# Altium schematic sheet CODEC.SchDoc: Audio Codec
size A3; Author: Vi Tín; SheetNumber: 11; SheetTotal: 15
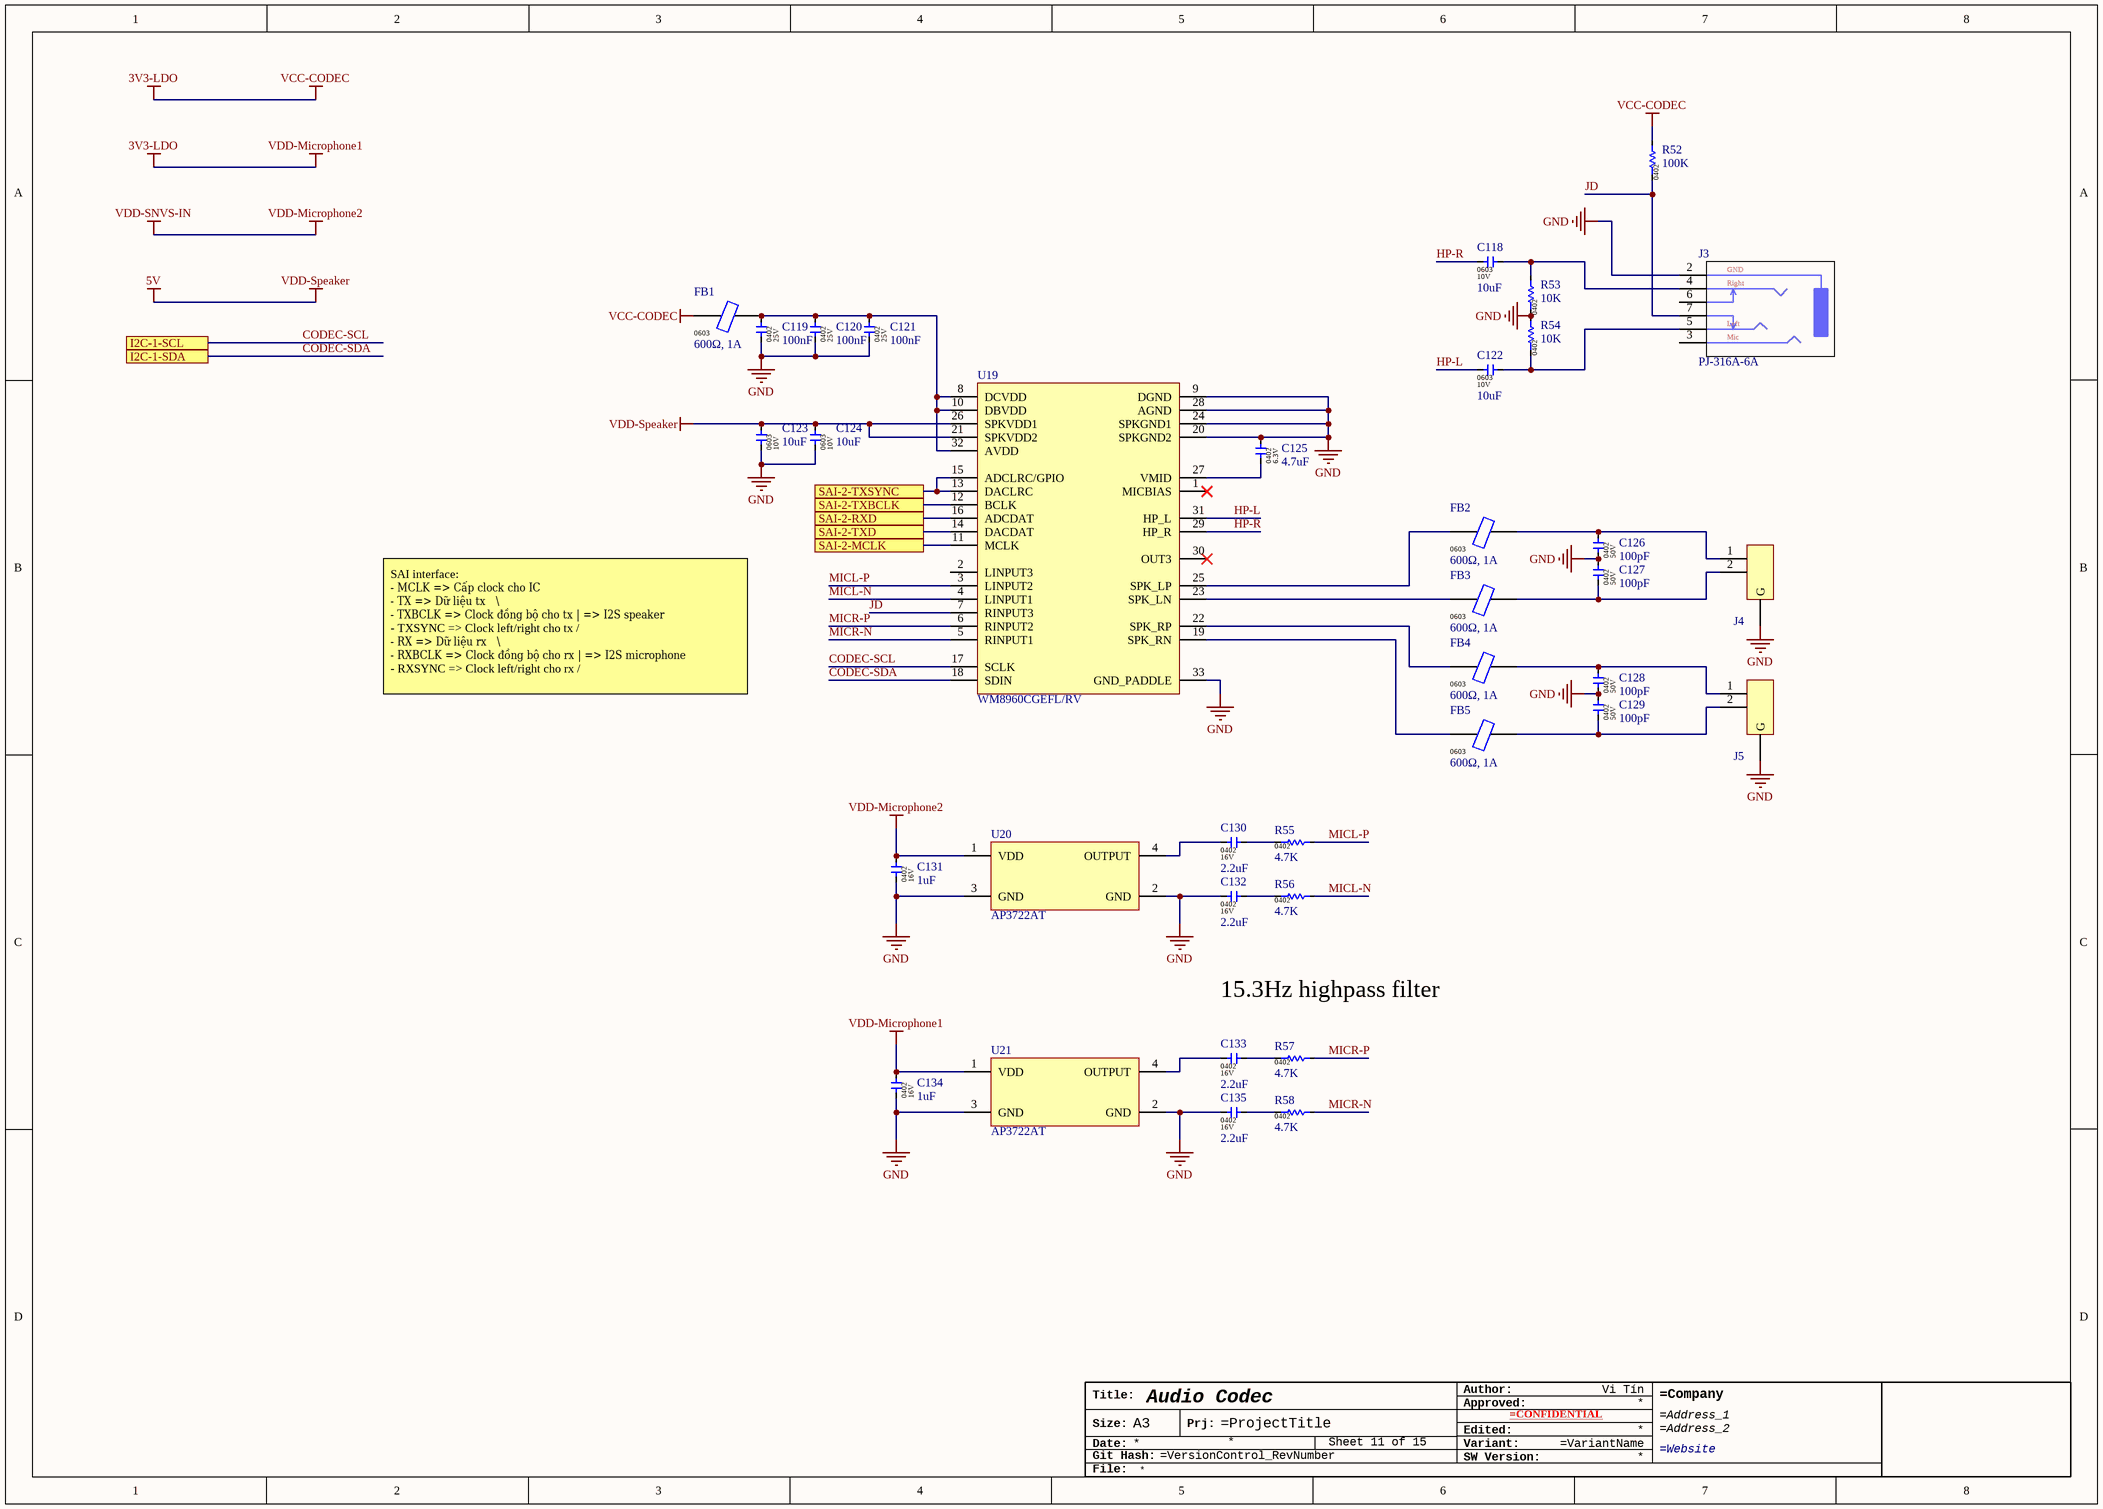
[diagram p0: CODEC.SchDoc]

## Parts
*?  TitleBlock_Generic  (value not drawn)  (graphical)
C118  10uF  [CAP-0603]
C119  100nF  [CAP-0402]
C120  100nF  [CAP-0402]
C121  100nF  [CAP-0402]
C122  10uF  [CAP-0603]
C123  10uF  [CAP-0603]
C124  10uF  [CAP-0603]
C125  4.7uF  [CAP-0402]
C126  100pF  [CAP-0402]
C127  100pF  [CAP-0402]
C128  100pF  [CAP-0402]
C129  100pF  [CAP-0402]
C130  2.2uF  [CAP-0402]
C131  1uF  [CAP-0402]
C132  2.2uF  [CAP-0402]
C133  2.2uF  [CAP-0402]
C134  1uF  [CAP-0402]
C135  2.2uF  [CAP-0402]
FB1  600Ω, 1A  [Ferrite-0603]
FB2  600Ω, 1A  [Ferrite-0603]
FB3  600Ω, 1A  [Ferrite-0603]
FB4  600Ω, 1A  [Ferrite-0603]
FB5  600Ω, 1A  [Ferrite-0603]
J3  PJ-316A-6A  [Audio 3.5mm, 6 pin]
J4  1.25T-2P-WT  [Conn MX1.25 (2)]  (value not drawn)
J5  1.25T-2P-WT  [Conn MX1.25 (2)]  (value not drawn)
R52  100K  [RES-0402]
R53  10K  [RES-0402]
R54  10K  [RES-0402]
R55  4.7K  [RES-0402]
R56  4.7K  [RES-0402]
R57  4.7K  [RES-0402]
R58  4.7K  [RES-0402]
U19  WM8960CGEFL/RV  [QFN32-5X5MM_PAD]
U20  AP3722AT  [AP3722AT]
U21  AP3722AT  [AP3722AT]

## Ports
I2C-1-SCL, I2C-1-SDA, SAI-2-MCLK, SAI-2-RXD, SAI-2-TXBCLK, SAI-2-TXD, SAI-2-TXSYNC

## Nets
3V3-LDO: C134.2 FB1.1 R52.2 U21.1(VDD)  [also labelled VCC-CODEC, VDD-Microphone1]
5V: C123.2 C124.2 U19.21(SPKVDD2) U19.26(SPKVDD1)  [also labelled VDD-Speaker]
GND: C119.1 C120.1 C121.1 C123.1 C124.1 C125.2 C126.1 C127.2 C128.1 C129.2 C131.1 C132.1 C134.1 C135.1 J3.2 J4.0(G) J5.0(G) R53.1 R54.2 U19.9(DGND) U19.20(SPKGND2) U19.24(SPKGND1) U19.28(AGND) U19.33(GND_PADDLE) U20.2(GND) U20.3(GND) U21.2(GND) U21.3(GND)
VDD-Microphone2: C131.2 U20.1(VDD)  [also labelled VDD-SNVS-IN]
CODEC-SCL: U19.17(SCLK) ; port I2C-1-SCL
CODEC-SDA: U19.18(SDIN) ; port I2C-1-SDA
HP-L: C122.1 U19.31(HP_L)
HP-R: C118.1 U19.29(HP_R)
JD: J3.7 R52.1 U19.7(RINPUT3)
MICL-N: R56.2 U19.4(LINPUT1)
MICL-P: R55.2 U19.3(LINPUT2)
MICR-N: R58.2 U19.5(RINPUT1)
MICR-P: R57.2 U19.6(RINPUT2)
SAI-2-MCLK: U19.11(MCLK) ; port SAI-2-MCLK
SAI-2-RXD: U19.16(ADCDAT) ; port SAI-2-RXD
SAI-2-TXBCLK: U19.12(BCLK) ; port SAI-2-TXBCLK
SAI-2-TXD: U19.14(DACDAT) ; port SAI-2-TXD
SAI-2-TXSYNC: U19.13(DACLRC) U19.15(ADCLRC/GPIO) ; port SAI-2-TXSYNC
NetC118_2: C118.2 J3.4 R53.2
NetC119_2: C119.2 C120.2 C121.2 FB1.2 U19.8(DCVDD) U19.10(DBVDD) U19.32(AVDD)
NetC122_2: C122.2 J3.5 R54.1
NetC125_1: C125.1 U19.27(VMID)
NetC126_2: C126.2 FB2.2 J4.1
NetC127_1: C127.1 FB3.2 J4.2
NetC128_2: C128.2 FB4.2 J5.1
NetC129_1: C129.1 FB5.2 J5.2
NetC130_1: C130.1 U20.4(OUTPUT)
NetC130_2: C130.2 R55.1
NetC132_2: C132.2 R56.1
NetC133_1: C133.1 U21.4(OUTPUT)
NetC133_2: C133.2 R57.1
NetC135_2: C135.2 R58.1
NetFB2_1: FB2.1 U19.25(SPK_LP)
NetFB3_1: FB3.1 U19.23(SPK_LN)
NetFB4_1: FB4.1 U19.22(SPK_RP)
NetFB5_1: FB5.1 U19.19(SPK_RN)

Not connected (* = marked no-connect by the designer): J3 3 6; U19 1(MICBIAS)* 2(LINPUT3) 30(OUT3)*

## Notes on the sheet
- SAI interface:
  - MCLK => Cấp clock cho IC
  - TX => Dữ liệu tx			\
  - TXBCLK => Clock đồng bộ cho tx	| => I2S speaker
  - TXSYNC => Clock left/right cho tx	/
  - RX => Dữ liệu rx			\
  - RXBCLK => Clock đồng bộ cho rx	| => I2S microphone
  - RXSYNC => Clock left/right cho rx	/
- 15.3Hz highpass filter
- (in symbol PJ-316A-6A) GND; Right; Left; Mic
- (in symbol TitleBlock_Generic) Author:; Title:; Approved:; Size:; A3; Prj:; Edited:; Date:; Variant:; SW Version:; Git Hash:; File:

## Library data of the parts
C118 C122-C124 = 0603X106M100CT: 10uF ±20% 10V X5R 0603 Multilayer Ceramic Capacitors MLCC - SMD/SMT RoHS; Manufacture: WALSIN; Package / Case: 0402; Component type: Capacitor; Manufacture part: 0603X106M100CT; Capacitor value: 10uF; Voltage: 10V; Package: 0603
C119-C121 = 0402X104K250CT: 100nF ±10% 25V X5R 0402 Multilayer Ceramic Capacitors MLCC - SMD/SMT RoHS; Manufacture: WALSIN; Package / Case: 0402; Component type: Capacitor; Manufacture part: 0402X104K250CT; Capacitor value: 100nF; Voltage: 25V; Package: 0402
C125 = 0402X475M6R3CT: 4.7uF ±20% 6.3V X5R 0402 Multilayer Ceramic Capacitors MLCC - SMD/SMT RoHS; Manufacture: WALSIN; Package / Case: 0402; Component type: Capacitor; Manufacture part: 0402X475M6R3CT; Capacitor value: 4.7uF; Voltage: 6.3V; Package: 0402
C126-C129 = 0402N101J500CT: 100pF ±5% 50V NP0 0402 Multilayer Ceramic Capacitors MLCC - SMD/SMT RoHS; Manufacture: WALSIN; Package / Case: 0402; Component type: Capacitor; Manufacture part: 0402N101J500CT; Capacitor value: 100pF; Voltage: 50V; Package: 0402
C130 C132 C133 C135 = EMK105ABJ225KV-F: X5R 2.2uF ±10% 16V 0402 Multilayer Ceramic Capacitors MLCC - SMD/SMT ROHS; Manufacture: Taiyo Yuden; Package / Case: 0402; Component type: Capacitor; Manufacture part: EMK105ABJ225KV-F; Capacitor value: 2.2uF; Voltage: 16V; Package: 0402
C131 C134 = 0402X105K160CT: 1uF ±10% 16V X5R 0402 Multilayer Ceramic Capacitors MLCC - SMD/SMT RoHS; Manufacture: WALSIN; Package / Case: 0402; Component type: Capacitor; Manufacture part: 0402X105K160CT; Capacitor value: 1uF; Voltage: 16V; Package: 0402
FB1-FB5 = UPZ1608E601-1R0TF: 600Ω @ 100MHz 1A 1 150mΩ 0603 Ferrite Beads RoHS; Manufacture: SUNLORD; Manufacture part: UPZ1608E601-1R0TF; Package: 0603; Value: 600Ω, 1A
J3 = PJ-316A-6A: 3.5mm SMD Headphone Holder 6 Female Horizontal SMD Audio & Video Connectors RoHS; Manufacture: Korean Hroparts Elec; Manufacture part: PJ-316A-6A; Type: Audio 3.5mm; Datasheet: https://datasheet.lcsc.com/lcsc/1810121710_Korean-Hroparts-Elec-PJ-316A-6A_C128987.pdf
J4 J5 = 1.25T-2P-WT: MX1.25 Header Male Pin 0.049"(1.25mm) 2 SMD,P=1.25mm Wire To Board / Wire To Wire Connector RoHS; Manufacture: Korean Hroparts Elec; Manufacture part: 1.25T-2P-WT; Type: MX1.25; Datasheet: https://datasheet.lcsc.com/lcsc/1903211731_Korean-Hroparts-Elec-1-25T-2P-WT_C145938.pdf
R52 = WR04X1003FTL: 100kΩ ±1% 1/16W ±100ppm/℃ 0402 Chip Resistor - Surface Mount RoHS; Manufacture: WALSIN; Package / Case: 0201; Component type: Resistor; Manufacture part: WR04X1003FTL; Resistor value: 100K; Package: 0402
R53 R54 = WR04X1002FTL: 10kΩ ±1% 1/16W ±100ppm/℃ 0402 Chip Resistor - Surface Mount RoHS; Manufacture: WALSIN; Package / Case: 0201; Component type: Resistor; Manufacture part: WR04X1002FTL; Resistor value: 10K; Package: 0402
R55-R58 = WR04X4701FTL: 4.7kΩ ±1% 1/16W ±100ppm/℃ 0402 Chip Resistor - Surface Mount RoHS; Manufacture: WALSIN; Package / Case: 0201; Component type: Resistor; Manufacture part: WR04X4701FTL; Resistor value: 4.7K; Package: 0402
U19 = WM8960CGEFL/RV: WM8960, stereo CODEC, Amplifier (2 Speaker); Manufacture: Cirrus Logic; Manufacture part: WM8960CGEFL/RV; Package: QFN-32 (5x5); Datasheet: https://datasheet.lcsc.com/lcsc/1809192324_Cirrus-Logic-WM8960CGEFL-RV_C18752.pdf
U20 U21 = AP3722AT: SMD,3.76x2.24x1.1mm MEMS Microphones ROHS; Manufacture: ALLPOWER(ShenZhen Quan Li Semiconductor); Manufacture part: AP3722AT; Package: N/A; Datasheet: https://datasheet.lcsc.com/lcsc/2011200934_ALLPOWER-ShenZhen-Quan-Li-Semiconductor-AP3722AT_C918198.pdf
*? = TitleBlock_Generic: Manufacture part: TitleBlock_Generic; Manufacture: N/A; Type: Graphic